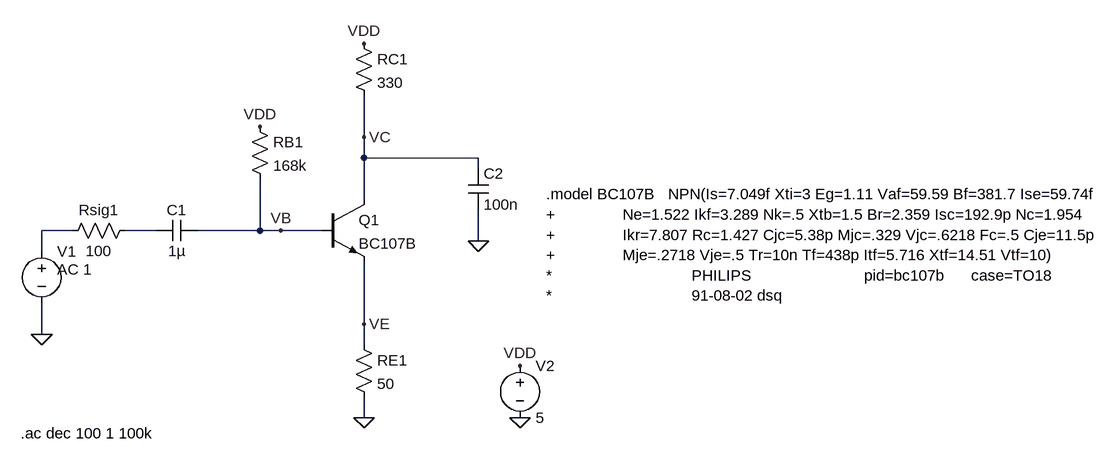
[diagram p0: schematic Homework3_BJT_DC_Gain.asc]
Homework3_BJT_DC_Gain.asc, the LTspice schematic file:
Version 4
SHEET 1 1152 680
WIRE -64 208 -64 144
WIRE -64 240 -64 208
WIRE 112 240 -64 240
WIRE 112 256 112 240
WIRE -64 304 -64 240
WIRE -512 352 -560 352
WIRE -384 352 -432 352
WIRE -224 352 -224 272
WIRE -224 352 -320 352
WIRE -192 352 -224 352
WIRE -128 352 -192 352
WIRE 112 368 112 320
WIRE -560 384 -560 352
WIRE -64 496 -64 400
WIRE -560 512 -560 464
WIRE -64 528 -64 496
WIRE -64 640 -64 608
FLAG -560 512 0
FLAG -64 640 0
FLAG 112 368 0
FLAG 176 640 0
FLAG 176 560 VDD
FLAG -64 64 VDD
FLAG -224 192 VDD
FLAG -192 352 VB
FLAG -64 496 VE
FLAG -64 208 VC
SYMBOL npn -128 304 R0
SYMATTR InstName Q1
SYMATTR Value BC107B
SYMBOL cap -320 336 R90
WINDOW 0 0 32 VBottom 2
WINDOW 3 32 32 VTop 2
SYMATTR InstName C1
SYMATTR Value 1µ
SYMBOL res -416 336 R90
WINDOW 0 0 56 VBottom 2
WINDOW 3 32 56 VTop 2
SYMATTR InstName Rsig1
SYMATTR Value 100
SYMBOL res -240 176 R0
SYMATTR InstName RB1
SYMATTR Value 168k
SYMBOL res -80 48 R0
SYMATTR InstName RC1
SYMATTR Value 330
SYMBOL res -80 512 R0
SYMATTR InstName RE1
SYMATTR Value 50
SYMBOL cap 96 256 R0
SYMATTR InstName C2
SYMATTR Value 100n
SYMBOL voltage -560 368 R0
WINDOW 123 24 44 Left 2
WINDOW 39 0 0 Left 0
SYMATTR Value2 AC 1
SYMATTR InstName V1
SYMATTR Value ""
SYMBOL voltage 176 544 R0
WINDOW 123 0 0 Left 0
WINDOW 39 0 0 Left 0
SYMATTR InstName V2
SYMATTR Value 5
TEXT 216 296 Left 2 !.model BC107B   NPN(Is=7.049f Xti=3 Eg=1.11 Vaf=59.59 Bf=381.7 Ise=59.74f\n+               Ne=1.522 Ikf=3.289 Nk=.5 Xtb=1.5 Br=2.359 Isc=192.9p Nc=1.954\n+               Ikr=7.807 Rc=1.427 Cjc=5.38p Mjc=.329 Vjc=.6218 Fc=.5 Cje=11.5p\n+               Mje=.2718 Vje=.5 Tr=10n Tf=438p Itf=5.716 Xtf=14.51 Vtf=10)\n*                               PHILIPS                         pid=bc107b      case=TO18\n*                               91-08-02 dsq
TEXT -592 664 Left 2 !.ac dec 100 1 100k

The netlist it stands for:
* Homework3_BJT_DC_Gain.asc
Q1 VC VB VE 0 BC107B
C1 VB N002 1µ
Rsig1 N002 N001 100
RB1 VDD VB 168k
RC1 VDD VC 330
RE1 VE 0 50
C2 VC 0 100n
V1 N001 0 AC 1
V2 VDD 0 5
.model NPN NPN
.model PNP PNP
.lib standard.bjt
.model BC107B   NPN(Is=7.049f Xti=3 Eg=1.11 Vaf=59.59 Bf=381.7 Ise=59.74f
+               Ne=1.522 Ikf=3.289 Nk=.5 Xtb=1.5 Br=2.359 Isc=192.9p Nc=1.954
+               Ikr=7.807 Rc=1.427 Cjc=5.38p Mjc=.329 Vjc=.6218 Fc=.5 Cje=11.5p
+               Mje=.2718 Vje=.5 Tr=10n Tf=438p Itf=5.716 Xtf=14.51 Vtf=10)
*                               PHILIPS                         pid=bc107b      case=TO18
*                               91-08-02 dsq
.ac dec 100 1 100k
.backanno
.end